# EAGLE design programmer (EAGLE 9.6.1)
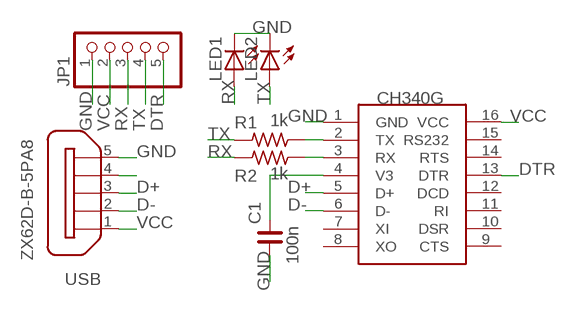
[diagram p0: schematic, sheet 1]

## Parts
C1  100n  C_2012  [C2012]
JP1  PINHD-1X5  [1X05]
LED1  LEDCHIP-LED0805  [CHIP-LED0805]
LED2  LEDCHIP-LED0805  [CHIP-LED0805]
R1  1k  R_2012  [R2012]
R2  1k  R_2012  [R2012]
U$1  CH340G  [SOIC16]
USB  ZX62D-B-5PA8  [ZX62D-B-5PA8]

## Nets
D+: U$1.5(D+) USB.3
D-: U$1.6(D-) USB.2
DTR: JP1.5 U$1.13(DTR)
GND: C1.1 JP1.1 LED1.C LED2.C U$1.1(GND) USB.5
N$1: C1.2 U$1.4(V3)
N$4: R1.2 U$1.2(TX)
N$5: USB.4
N$6: R2.2 U$1.3(RX)
RX: JP1.3 LED1.A R2.1
TX: JP1.4 LED2.A R1.1
VCC: JP1.2 U$1.16(VCC) USB.1
Unconnected: U$1.7(XI) U$1.8(XO) U$1.9(CTS) U$1.10(DSR) U$1.11(RI) U$1.12(DCD) U$1.14(RTS) U$1.15(RS232) USB.S1 USB.S2 USB.S3 USB.S4

## Library data of the parts
C1 = rc-master-smd:C_: NON-POLARIZED CAP
JP1 = pinhead:PINHD-1X5: PIN HEADER
LED1 LED2 = adafruit:LED: LED OSRAM: - CHIPLED LG R971, LG N971, LY N971, LG Q971, LY Q971, LO R971, LY R971 LH N974, LH R974 LS Q976, LO Q976, LY Q976 LO Q996 - Hyper CHIPLED LW Q18S LB Q993, LB Q99A, LB R99A - SideLED LS A670, LO A670, LY A670, LG A670, LP A670 LB A673, LV A673, LT A673, LW A673 LH A674 LY A675 LS A676, LA A676, LO A676, LY A676, LW A676 LS A679, LY A679, LG A679 - Hyper Micro SIDELED® LS Y876, LA Y876, LO Y876, LY Y876 LT Y87S - SmartLED LW L88C, LW L88S LB L89C, LB L89S, LG L890 LS L89K, LO L89K, LY L89K LS L896, LA L896, LO L896, LY L896 - TOPLED LS T670, LO T670, LY T670, LG T670, LP T670 LSG T670, LSP T670, LSY T670, LOP T670, LYG T670 LG T671, LOG T671, LSG T671 LB T673, LV T673, LT T673, LW T673 LH T674 LS T676, LA T676, LO T676, LY T676, LB T676, LH T676, LSB T676, LW T676 LB T67C, LV T67C, LT T67C, LS T67K, LO T67K, LY T67K, LW E67C LS E67B, LA E67B, LO E67B, LY E67B, LB E67C, LV E67C, LT E67C LW T67C LS T679, LY T679, LG T679 LS T770, LO T770, LY T770, LG T770, LP T770 LB T773, LV T773, LT T773, LW T773 LH T774 LS E675, LA E675, LY E675, LS T675 LS T776, LA T776, LO T776, LY T776, LB T776 LHGB T686 LT T68C, LB T68C - Hyper Mini TOPLED® LB M676 - Mini TOPLED Santana® LG M470 LS M47K, LO M47K, LY M47K Source: http://www.osram.convergy.de/
R1 R2 = rc-master-smd:R_: RESISTOR
U$1 = ch340g:CH340G
USB = zx62d-b-5pa8-oshpark_10:ZX62D-B-5PA8: Micro USB Type B Connector - Standard, Shell Through Hole Source: http://www.hirose.co.jp/cataloge_hp/ed_ZX_20140804.pdf; MF: Hirose; MPN: ZX62D-B-5PA8; OC_FARNELL: 2300438; OC_NEWARK: 69W0712

## Board
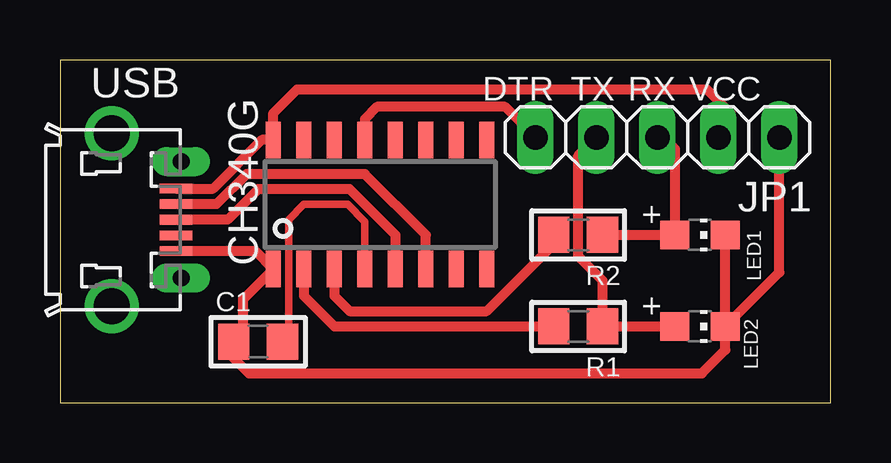
[diagram p1: board, top side]

Size 32.11 x 14.28 mm. Coordinates in mm from the lower left corner, seen from the top.
Outline: 0,0 32.11,0 32.11,14.28 0,14.28 0,0
Copper layers (1*16): Top 0.035mm / dielectric 1.5mm / Bottom 0.035mm
Design rules "default": minimum track width 6mil, minimum drill 0.35mm, track to track 6mil, track to pad 6mil, pad to pad 6mil, via to via 6mil, smd to smd 6mil, copper to edge 40mil, drill to drill 6mil, minimum pad ring 10mil, minimum via ring 8mil, stop-mask expansion 4mil, vias tented up to drill 0mil, thermal gap 10mil

### Footprints (pad centres in the part's own frame; a part is rotated, then mirrored left to right if it is on the bottom)
C2012 = smd 1.3 x 1.5: 1 -1.016,0; 2 1.016,0
1X05 = drill 1.016 long: 1 -5.08,0; 2 -2.54,0; 3 0,0; 4 2.54,0; 5 5.08,0
CHIP-LED0805 = smd 1.2 x 1.2: A 0,-1.05; C 0,1.05
R2012 = smd 1.3 x 1.5: 1 -1.016,0; 2 1.016,0
SOIC16 = smd 0.635 x 1.524: 1 -4.445,-2.695; 2 -3.175,-2.695; 3 -1.905,-2.695; 4 -0.635,-2.695; 5 0.635,-2.695; 6 1.905,-2.695; 7 3.175,-2.695; 8 4.445,-2.695; 9 4.445,2.695; 10 3.175,2.695; 11 1.905,2.695; 12 0.635,2.695; 13 -0.635,2.695; 14 -1.905,2.695; 15 -3.175,2.695; 16 -4.445,2.695
ZX62D-B-5PA8 = smd 1.35 x 0.4: 1 4.825,1.3; 2 4.825,0.65; 3 4.825,0; 4 4.825,-0.65; 5 4.825,-1.3 | drill 1.5: S1 2.15,-3.6; S2 2.15,3.6 | drill 0.7 long: S3 5.05,2.425; S4 5.05,-2.425

### Placement (x,y rotation side)
C1  8.26,2.54 0 top
JP1  24.89,11.05 180 top
LED1  26.67,6.98 270 top
LED2  26.67,3.17 270 top
R1  21.59,3.17 180 top
R2  21.59,6.98 180 top
U$1  13.34,8.26 0 top
USB  0,7.62 0 top

### Tracks (layer width: path | path; a pad name or v marks a point on that pad's centre or on a via)
D+
  Top 0.406: U$1.5 13.97,6.98 12.06,8.89 8.26,8.89 6.99,7.62 USB.3
D-
  Top 0.406: U$1.6 15.24,6.98 12.7,9.53 7.78,9.53 6.52,8.27 USB.2
DTR
  Top 0.406: U$1.13 12.7,11.81 13.21,12.32 18.54,12.32 JP1.5
GND
  Top 0.406: USB.5 8.13,6.32 U$1.1 7.62,4.29 7.62,2.92 C1.1 | C1.1 7.62,2.16 | C1.1 7.24,1.85 7.87,1.22 26.75,1.22 27.72,2.19 LED2.C | LED2.C LED1.C | LED2.C 29.97,5.43 JP1.1
N$1
  Top 0.305: U$1.4 12.7,7.54 11.98,8.26 10.16,8.26 9.53,7.62 9.53,2.92 9.27,2.67 C1.2
N$4
  Top 0.406: U$1.2 10.16,4.45 11.43,3.17 R1.2
N$6
  Top 0.406: U$1.3 11.43,4.45 12.06,3.81 17.78,3.81 20.57,6.6 R2.2
RX
  Top 0.406: R2.1 LED1.A 25.62,10.57 25.15,11.05 JP1.3
TX
  Top 0.406: LED2.A R1.1 22.61,5.08 21.6,6.09 21.6,10.3 JP1.4
VCC
  Top 0.406: USB.1 6.38,8.92 8.41,10.95 U$1.16 8.89,12.06 9.88,13.06 26.95,13.06 27.43,12.57 | 27.43,12.57 27.94,12.06 | JP1.2 27.43,12.57

### Text on the board
tPlace: DTR | TX | RX | VCC